# EAGLE schematic SMPS (EAGLE 6.4)
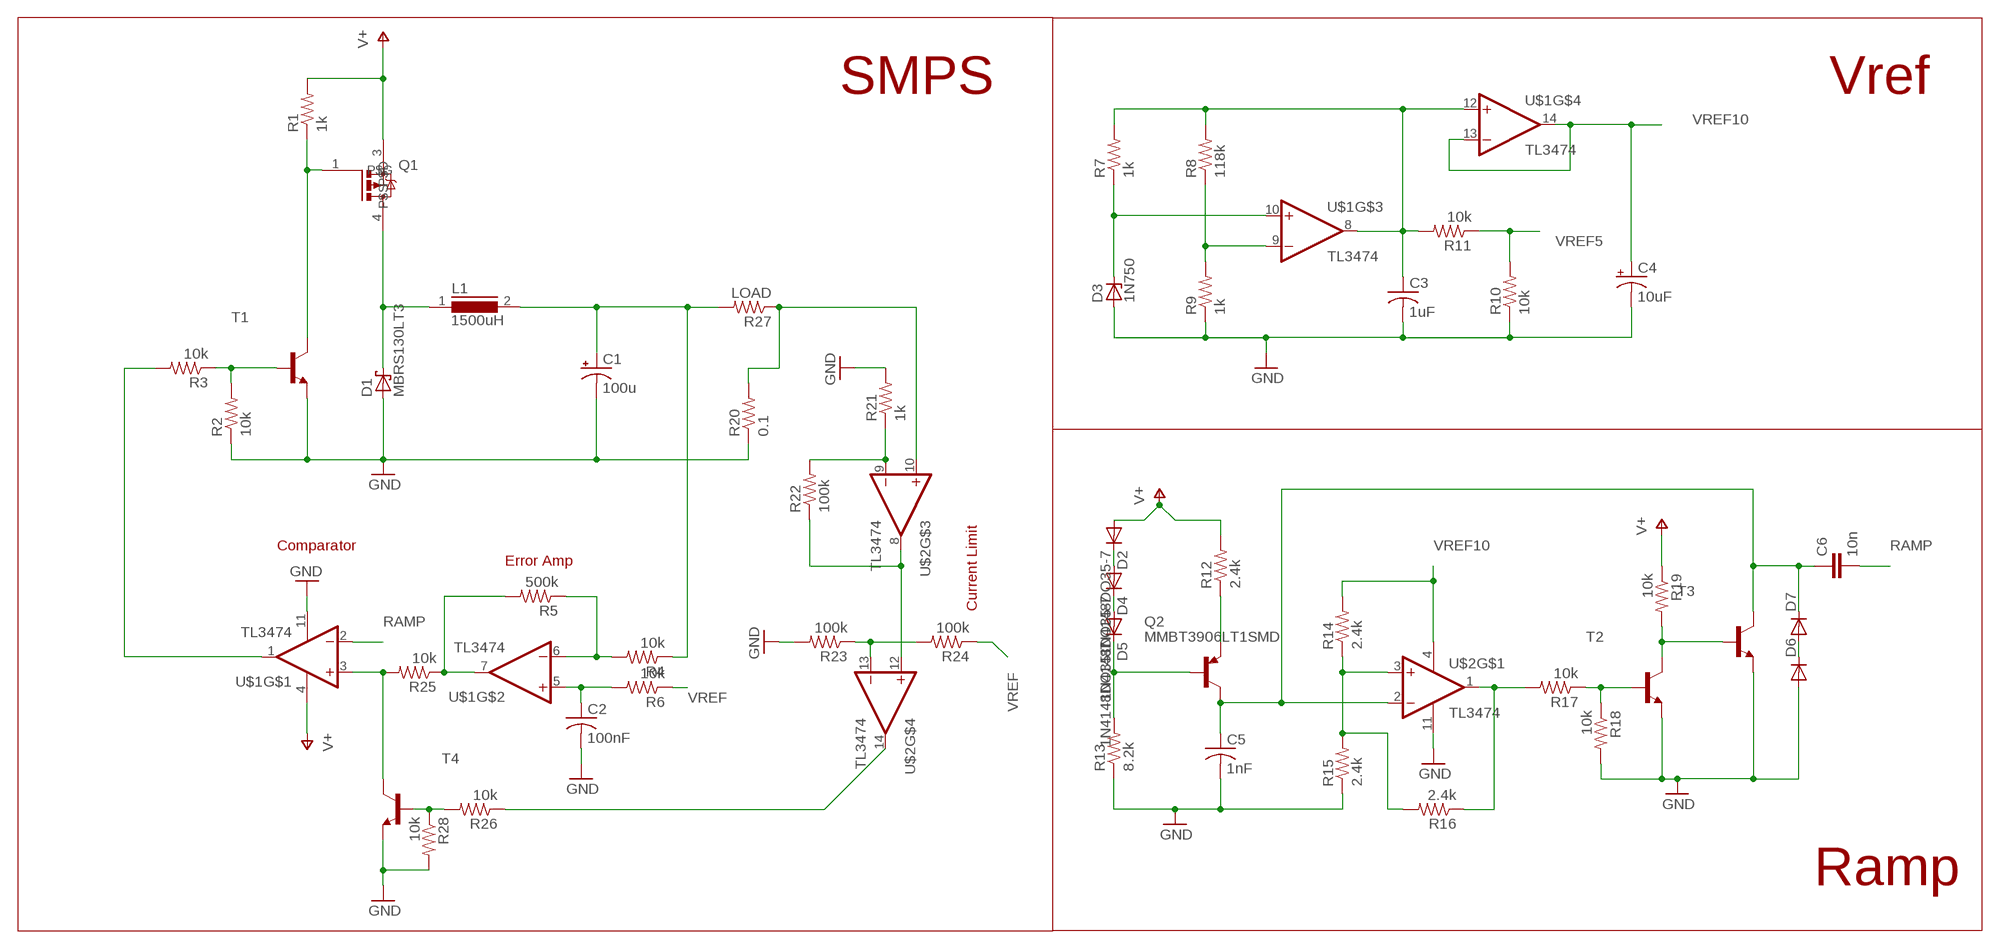
[diagram p0: schematic, sheet 1]

## Parts
C1  100u  CPOL-USE7.5-16  [E7,5-16]
C2  100nF  C-USC0805  [C0805]
C3  1uF  C-USC0805  [C0805]
C4  10uF  CPOL-USE7.5-16  [E7,5-16]
C5  1nF  C-USC0805  [C0805]
C6  10n  C-EUC0805  [C0805]
D1  MBRS130LT3  [SMB]
D2  1N4148DO35-7  [DO35-7]
D3  1N750  ZENER-DIODEZD-7.5  [ZDIO-7.5]
D4  1N4148DO35-7  [DO35-7]
D5  1N4148DO35-7  [DO35-7]
D6  1N4148DO35-7  [DO35-7]
D7  1N4148DO35-7  [DO35-7]
L1  1500uH  82114R  [82114R]
Q1  IRFR9024NDPAK  [D-PAK_TO252AA]
Q2  MMBT3906LT1SMD  [SOT23-BEC]
R1  1k  R-US_R0805  [R0805]
R2  10k  R-US_R0805  [R0805]
R3  10k  R-US_R0805  [R0805]
R4  10k  R-US_R0805  [R0805]
R5  500k  R-US_R0805  [R0805]
R6  10k  R-US_R0805  [R0805]
R7  1k  R-US_R0805  [R0805]
R8  118k  R-US_R0805  [R0805]
R9  1k  R-US_R0805  [R0805]
R10  10k  R-US_R0805  [R0805]
R11  10k  R-US_R0805  [R0805]
R12  2.4k  R-US_R0805  [R0805]
R13  8.2k  R-US_R0805  [R0805]
R14  2.4k  R-US_R0805  [R0805]
R15  2.4k  R-US_R0805  [R0805]
R16  2.4k  R-US_R0805  [R0805]
R17  10k  R-US_R0805  [R0805]
R18  10k  R-US_R0805  [R0805]
R19  10k  R-US_R0805  [R0805]
R20  0.1  R-US_R1206  [R1206]
R21  1k  R-US_R0805  [R0805]
R22  100k  R-US_R0805  [R0805]
R23  100k  R-US_R0805  [R0805]
R24  100k  R-US_R0805  [R0805]
R25  10k  R-US_R0805  [R0805]
R26  10k  R-US_R0805  [R0805]
R27  LOAD  R-US_R0805  [R0805]
R28  10k  R-US_R0805  [R0805]
T1  MMBT2222ALT1-NPN-SOT23-BEC  [SOT23-BEC]
T2  MMBT2222ALT1-NPN-SOT23-BEC  [SOT23-BEC]
T3  MMBT2222ALT1-NPN-SOT23-BEC  [SOT23-BEC]
T4  MMBT2222ALT1-NPN-SOT23-BEC  [SOT23-BEC]
U$1  TL3474  [SO14]
U$2  TL3474  [SO14]

## Nets
GND: C1.- C2.2 C3.2 C4.- C5.2 D1.A D3.A D6.A R2.1 R9.1 R10.1 R13.1 R15.1 R18.2 R20.1 R21.2 R23.2 R28.2 T1.E T2.E T3.E T4.E U$1.11(V-) U$2.11(V-)
N$1: Q1.1(P$G) R1.1 T1.C
N$2: R2.2 R3.1 T1.B
N$3: R3.2 U$1.1(OUT)
N$4: C2.1 R6.2 U$1.5(+IN)
N$5: D1.C L1.1 Q1.4(P$D)
N$6: C1.+ L1.2 R4.1 R27.2
N$7: R5.2 R25.1 U$1.7(OUT)
N$8: D3.C R7.1 U$1.10(+IN)
N$9: R4.2 R5.1 U$1.6(-IN)
N$10: R8.1 R9.2 U$1.9(-IN)
N$11: Q2.E R12.1
N$12: R20.2 R27.1 U$2.10(+IN)
N$13: D6.C D7.A
N$14: D5.C Q2.B R13.2
N$15: D4.C D5.A
N$16: D2.C D4.A
N$17: R14.1 R15.2 R16.2 U$2.3(+IN)
N$18: C5.1 C6.1 D7.C Q2.C T3.C U$2.2(-IN)
N$19: R21.1 R22.2 U$2.9(-IN)
N$20: R16.1 R17.2 U$2.1(OUT)
N$21: R17.1 R18.1 T2.B
N$22: R22.1 U$2.8(OUT) U$2.12(+IN)
N$23: R23.1 R24.2 U$2.13(-IN)
N$24: R19.2 T2.C T3.B
N$25: R25.2 T4.C U$1.3(+IN)
N$26: R26.2 R28.1 T4.B
N$27: R26.1 U$2.14(OUT)
RAMP: C6.2 U$1.2(-IN)
V+: D2.A Q1.3(P$S) R1.2 R12.2 R19.1 U$1.4(V+)
VR10: C3.1 R7.2 R8.2 R11.2 U$1.8(OUT) U$1.12(+IN)
VREF: R6.1 R24.1
VREF5: R10.2 R11.1
VREF10: C4.+ R14.2 U$1.13(-IN) U$1.14(OUT) U$2.4(V+)
Unconnected: U$2.5(+IN) U$2.6(-IN) U$2.7(OUT)

## Notes on the sheet
- SMPS | Vref
- Comparator
- Error Amp
- Current Limit
- Ramp

## Library data of the parts
C1 C4 = resistor:CPOL-US: POLARIZED CAPACITOR, American symbol
C2 C3 C5 = resistor:C-US: CAPACITOR, American symbol
C6 = resistor:C-EU: CAPACITOR, European symbol
D1 = diode:MBRS130LT3: Schottky Power Rectifier Source: http://www.onsemi.com/pub/Collateral/MBRS130LT3-D.PDF
D2 D4-D7 = diode:1N4148: DIODE high speed (Philips)
D3 = diode:ZENER-DIODE: Z-Diode
L1 = inductors:82114R: INDUCTOR
Q1 = RobThePyro:IRFR9024N: http://www.irf.com/product-info/datasheets/data/irfr9024n.pdf
Q2 = transistor-pnp:MMBT3906*: PNP Transistror
R1-R28 = resistor:R-US_: RESISTOR, American symbol
T1-T4 = transistor:*-NPN-: NPN Transistror BF959 corrected 2008.03.06
U$1 U$2 = linear:TL3474